# EasyEDA Pro project Hikikomori-base-esp32c6-dev-v0.1.epro

# Schematic Main board
Board Name: Main board; Create Date: 2024-10-02; Page Name: P1; Project Name: Hikikomori-base-esp32c6-dev-v0.1; Schematic Name: Main board; Update Date: 2024-12-02; Company: Robonomics.network; Drawed: ludovich88; Page Size: A4; Part Number: SWS-1G-E-ESP_MB; Reviewed: ludovich88; Version: V0.1
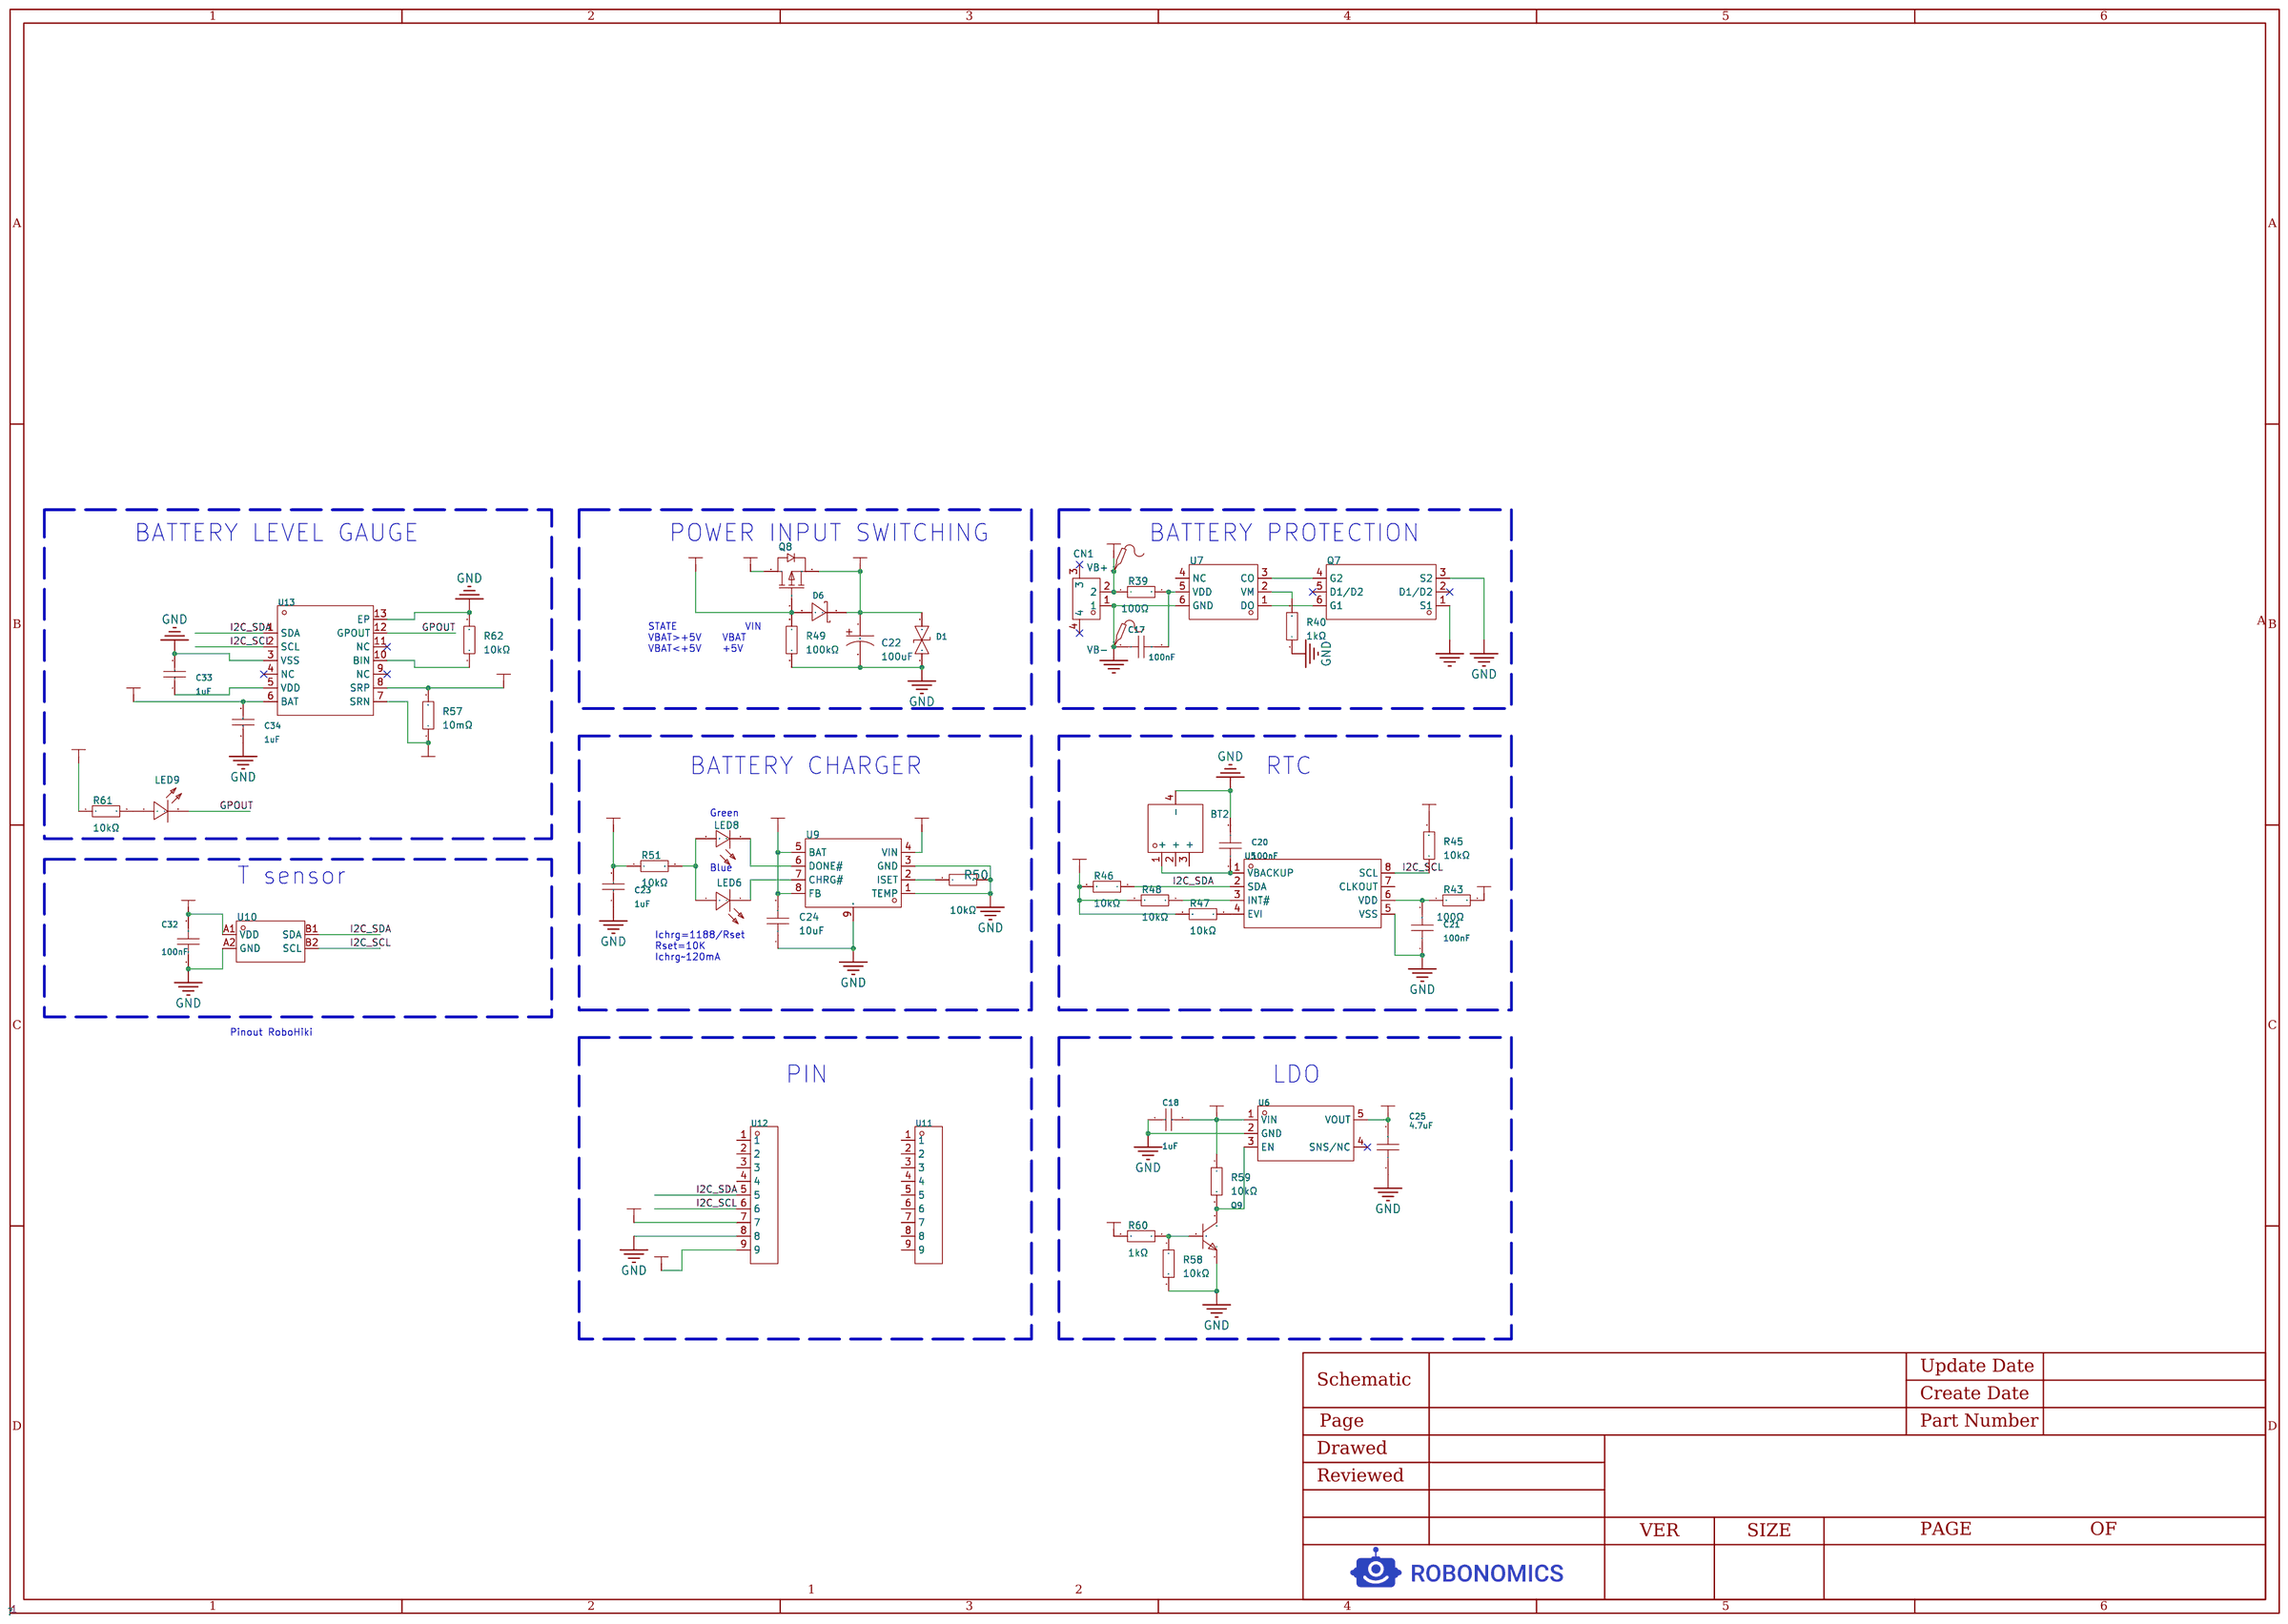
[diagram p0: schematic sheet]

## Parts
BT2  MY-521-01  [BAT-SMD_MY-521-01]
C17  100nF  [C0402]
C18  1uF  [C0402]
C20  100nF  [C0402]
C21  100nF  [C0402]
C22  100uF  [CAP-SMD_L3.5-W2.8-R-RD]
C23  1uF  [C0402]
C24  10uF  [C0402]
C25  4.7uF  [C0402]
C32  100nF  [C0402]
C33  1uF  [C0402]
C34  1uF  [C0402]
CN1  A2001WR-S-2P  [CONN-SMD_2P-P2.00_A2001WR-S-2P]  (no BOM)
D1  LESD5D5.0CT1G  [SOD-523_L1.2-W0.8-LS1.6-BI]
D6  BAT60AE6327  [SOD-323_L1.8-W1.3-LS2.5-RD]
LED6  16-213/BHC-AN1P2/3T  [LED0402-R-RD]
LED8  16-213/GHC-YR1S1/3T  [LED0402-R-RD]
LED9  16-213UYOC/S530-A2/TR8  [LED0402-R-RD]
Q7  SL8205S  [SOT-23-6_L2.9-W1.6-P0.95-LS2.8-BL]
Q8  CJ2301 S1  [SOT-23-3_L3.0-W1.7-P0.95-LS2.9-BR]
Q9  2N3904S-RTK/PS  [SOT-23-3_L2.9-W1.3-P1.90-LS2.4-TR]
R39  100Ω  [R0402]
R40  1kΩ  [R0402]
R43  100Ω  [R0402]
R45  10kΩ  [R0402]
R46  10kΩ  [R0402]
R47  10kΩ  [R0402]
R48  10kΩ  [R0402]
R49  100kΩ  [R0402]
R50  10kΩ  [R0603]
R51  10kΩ  [R0402]
R57  10mΩ  [R0603]
R58  10kΩ  [R0402]
R59  10kΩ  [R0402]
R60  1kΩ  [R0402]  (no BOM)
R61  10kΩ  [R0402]
R62  10kΩ  [R0402]
U5  RV-3032-C7-32.768KHZ-2.5PPM-TA-QA  [DFN-8_L3.2-W1.5-P0.9-BL]
U6  RT9078-33GJ5  [TSOT-23-5_L2.9-W1.6-P0.95-LS2.8-BR]
U7  DW01A  [SOT-23-6_L2.9-W1.6-P0.95-LS2.8-BL]
U9  CN3165  [DFN-8_L3.0-W3.0-P0.50-BL-EP]
U10  MAX31875R0TZS+T  [WLP-4_L0.8-W0.8-R2-C2-P0.40-TL]
U11  XDZ254-1-09-Z-2.5-G1  [HDR-TH_9P-P2.54-V-M]
U12  XDZ254-1-09-Z-2.5-G1  [HDR-TH_9P-P2.54-V-M]
U13  BQ27441DRZR-G1B  [SON-12_L4.0-W2.5-P0.40-BL-EP]
VB+  -  [Test-Point-0.5mm]  (no BOM)
VB-  -  [Test-Point-0.5mm]  (no BOM)

## Library data of the parts
BT2 = MY-521-01: Connector Type:Battery clip Battery Type:SR521 Contact Material:Phosphor Bronze Contact Plating:Silver Operating Temperature Range:- Operating Temperature Range:-; LCSC Part Name: 电池扣 适用电池:SR521; Supplier Part: C964848; Manufacturer: MYOUNG(美阳); Supplier Footprint: SMD; Datasheet: https://atta.szlcsc.com/upload/public/pdf/source/20201218/C964848_4AB8D6E0B12E9D850A42CAB87A92C7AA.pdf; Supplier: LCSC; Connector Type: Battery clip; Battery Type: SR521; Contact Material: Phosphor Bronze; Contact Plating: Silver
C17 C20 C21 C32 = CC0402KRX7R7BB104: Capacitance: Tolerance:±10% Tolerance:±10% Voltage Rated: Temperature Coefficient:; LCSC Part Name: 100nF ±10% 16V; Supplier Part: C60474; Manufacturer: YAGEO(国巨); Supplier Footprint: 0402; Datasheet: https://atta.szlcsc.com/upload/public/pdf/source/20211223/9278FD768280B81DDBEF48FA36411A03.pdf; Supplier: LCSC; Tolerance: ±10%
C18 C23 C33 C34 = CL05A105KO5NNNC: Capacitance: Tolerance:±10% Tolerance:±10% Voltage Rated: Temperature Coefficient:; LCSC Part Name: 1uF ±10% 16V; Supplier Part: C29266; Manufacturer: SAMSUNG(三星); Supplier Footprint: 0402; Datasheet: https://atta.szlcsc.com/upload/public/pdf/source/20160218/1457707763339.pdf; Supplier: LCSC; Tolerance: ±10%
C22 = 293D107X96R3B2TE3: Capacitance: Tolerance:±10% Tolerance:±10% Rated Voltage: Equivalent Series Resistance(ESR):1.7Ω@100kHz Operating Temperature:-55℃~+125℃ Operating Temperature:-55℃~+125℃; LCSC Part Name: 100uF ±10% 6.3V; Supplier Part: C136004; Manufacturer: VISHAY(威世); Supplier Footprint: CASE-B-3528; JLCPCB Part Class: Extended Part; Datasheet: https://atta.szlcsc.com/upload/public/pdf/source/20180326/C136005_D73530D2C967FFE6345491EA9D499B4C.pdf; Supplier: LCSC; Tolerance: ±10%; Equivalent Series Resistance(ESR): 1.7Ω@100kHz; Operating Temperature: -55℃~+125℃
C24 = CL05A106MP5NUNC_C315248: Capacitance: Tolerance:±20% Tolerance:±20% Voltage Rated: Temperature Coefficient:; LCSC Part Name: 10uF ±20% 10V; Supplier Part: C315248; Manufacturer: SAMSUNG(三星); Manufacturer Part: CL05A106MP5NUNC; Supplier Footprint: 0402; Datasheet: https://atta.szlcsc.com/upload/public/pdf/source/20231220/1EF805BAE1520675928CC4638D279E74.pdf; Supplier: LCSC; Tolerance: ±20%
C25 = CL05A475KP5NRNC: Capacitance: Tolerance:±10% Tolerance:±10% Voltage Rated: Temperature Coefficient:; LCSC Part Name: 4.7uF ±10% 10V; Supplier Part: C368809; Manufacturer: SAMSUNG(三星); Supplier Footprint: 0402; Datasheet: https://atta.szlcsc.com/upload/public/pdf/source/20160218/1457707763339.pdf; Supplier: LCSC; Tolerance: ±10%
CN1 = A2001WR-S-2P: LCSC Part Name: PH2.0 卧贴 1X2P; Supplier Part: C375128; Manufacturer: CNJM(九木精密); Supplier Footprint: SMD; Datasheet: https://atta.szlcsc.com/upload/public/pdf/source/20190312/C375153_A3CA63057DD9112FB0BD059C4CD87155.pdf; Supplier: LCSC
D1 = LESD5D5.0CT1G: polarity:Bi-Directional Reverse Stand-Off Voltage (Vrwm):5V Maximum Clamping Voltage:18.6V Peak Pulse Current (Ipp)@10/1000us:9.4A Breakdown Voltage:5.6V Type:ESD; LCSC Part Name: 双向ESD; Supplier Part: C383211; Manufacturer: LRC(乐山无线电); Supplier Footprint: SOD-523; JLCPCB Part Class: Extended Part; Datasheet: https://atta.szlcsc.com/upload/public/pdf/source/20190807/C383211_633DF4B4E2C161403226E5235FE33A1C.pdf; Supplier: LCSC; polarity: Bi-Directional; Reverse Stand-Off Voltage (Vrwm): 5V; Maximum Clamping Voltage: 18.6V; Peak Pulse Current (Ipp)@10/1000us: 9.4A; Breakdown Voltage: 5.6V; Type: ESD
D6 = BAT60AE6327_C117485: Forward Voltage (Vf@If):370mV@1A Reverse Voltage (Vr):10V Average Rectified Current (Io):3A; LCSC Part Name: 电压:10V 电流:3A; Supplier Part: C117485; Manufacturer: Infineon(英飞凌); Supplier Footprint: SOD-323; Datasheet: https://atta.szlcsc.com/upload/public/pdf/source/20190819/C412736_AE17339F97C252D9C798252AC051EF30.pdf; Supplier: LCSC; Forward Voltage (Vf@If): 370mV@1A; Reverse Voltage (Vr): 10V; Average Rectified Current (Io): 3A
LED6 = 16-213/BHC-AN1P2/3T: Emitted Color:Blue; LCSC Part Name: 蓝灯; Supplier Part: C131223; Manufacturer: EVERLIGHT(亿光); Supplier Footprint: 0402; JLCPCB Part Class: Extended Part; Datasheet: https://atta.szlcsc.com/upload/public/pdf/source/20180227/C131223_15197014144351370257.pdf; Supplier: LCSC; Emitted Color: Blue
LED8 = 16-213/GHC-YR1S1/3T: Emitted Color:Emerald Power Dissipation:110mW Forward Current:20mA Dominant Wavelength:520nm~535nm Dominant Wavelength:520nm~535nm Peak Wavelength:518nm Diode Configuration:- Lens Color:无色透明透镜 Color Temperature:- Color Temperature:- Viewing Angle:120° Mou; LCSC Part Name: 翠绿; Supplier Part: C74338; Manufacturer: EVERLIGHT(亿光); Supplier Footprint: 0402; Datasheet: https://atta.szlcsc.com/upload/public/pdf/source/20160606/1465200212329.pdf; Supplier: LCSC; Emitted Color: Emerald; Power Dissipation: 110mW; Forward Current: 20mA; Dominant Wavelength: 520nm~535nm; Peak Wavelength: 518nm; Lens Color: 无色透明透镜; Viewing Angle: 120°; Operating Temperature: -40℃~+85℃
LED9 = 16-213UYOC/S530-A2/TR8: Emitted Color:Orange; LCSC Part Name: 橙灯; Supplier Part: C88330; Manufacturer: EVERLIGHT(亿光); Supplier Footprint: 0402; JLCPCB Part Class: Extended Part; Datasheet: https://atta.szlcsc.com/upload/public/pdf/source/20180423/C88330_69D68B8C9D59C37D6019D2A42E6579CE.pdf; Supplier: LCSC; Emitted Color: Orange
Q7 = SL8205S: Type:2 N-Channel Drain Source Voltage (Vdss): Continuous Drain Current (Id): Power Dissipation (Pd): Drain Source On Resistance (RDS(on)@Vgs,Id):27mΩ@4.5V,5A Gate Threshold Voltage (Vgs(th)@Id):1.2V@250uA Configuration:Common Drain; LCSC Part Name: 2个N沟道 耐压:20V 电流:5A; Supplier Part: C359990; Manufacturer: Slkor(萨科微); Supplier Footprint: SOT-23-6; JLCPCB Part Class: Extended Part; Datasheet: https://atta.szlcsc.com/upload/public/pdf/source/20190627/C359990_9C880E926E3F18206F64B33A1D5D570E.pdf; Supplier: LCSC; Type: 2 N-Channel; Drain Source On Resistance (RDS(on)@Vgs,Id): 27mΩ@4.5V,5A; Gate Threshold Voltage (Vgs(th)@Id): 1.2V@250uA; Configuration: Common Drain
Q8 = CJ2301 S1: Type:1个PChannel Drain Source Voltage (Vdss): Continuous Drain Current (Id): Power Dissipation (Pd): Drain Source On Resistance (RDS(on)@Vgs,Id):112mΩ@4.5V,2.8A Gate Threshold Voltage (Vgs(th)@Id):1V@250uA Total Gate Charge (Qg@Vgs):- Input Capacitance (Ci; LCSC Part Name: 1个P沟道 耐压:20V 电流:2.3A; Supplier Part: C8547; Manufacturer: CJ(江苏长电/长晶); Supplier Footprint: SOT-23; JLCPCB Part Class: Extended Part; Datasheet: https://atta.szlcsc.com/upload/public/pdf/source/20140815/1457707224119.pdf; Supplier: LCSC; Type: 1个PChannel; Drain Source On Resistance (RDS(on)@Vgs,Id): 112mΩ@4.5V,2.8A; Gate Threshold Voltage (Vgs(th)@Id): 1V@250uA
Q9 = 2N3904S-RTK/PS_C18536: Transistor Type: Collector Current (Ic): Collector-Emitter Breakdown Voltage (Vceo): Power Dissipation (Pd): DC Current Gain (hFE@Ic,Vce):100@10mA,1V DC Current Gain (hFE@Ic,Vce):100@10mA,1V Transition Frequency (fT):300MHz Collector Cut-Off Current (Icbo; LCSC Part Name: NPN 电流:200mA 耐压:40V; Supplier Part: C18536; Manufacturer: KEC; Supplier Footprint: SOT-23; JLCPCB Part Class: Extended Part; Datasheet: https://atta.szlcsc.com/upload/public/pdf/source/20180105/C112667_15151500846781234146.pdf; Supplier: LCSC; DC Current Gain (hFE@Ic,Vce): 100@10mA,1V; Transition Frequency (fT): 300MHz; Collector-Emitter Saturation Voltage (VCE(sat)@Ic,Ib): 300mV@50mA,5mA
R39 R43 = RC0402FR-07100RL: Type:Thick Film Resistors Resistance: Tolerance:±1% Tolerance:±1% Power(Watts): Overload Voltage (Max): Temperature Coefficient:±100ppm/℃ Temperature Coefficient:±100ppm/℃ Operating Temperature Range:-55℃~+155℃ Operating Temperature Range:-55℃~+155℃; LCSC Part Name: 厚膜电阻 100Ω ±1% 62.5mW; Supplier Part: C106232; Manufacturer: YAGEO(国巨); Supplier Footprint: 0402; JLCPCB Part Class: Extended Part; Datasheet: https://atta.szlcsc.com/upload/public/pdf/source/20180927/C295883_E8D83085EA81BD7DE0B2B681138C15EE.pdf; Supplier: LCSC; Type: Thick Film Resistors; Tolerance: ±1%; Temperature Coefficient: ±100ppm/℃; Operating Temperature Range: -55℃~+155℃
R40 R60 = RC0402FR-071KL: Type:Thick Film Resistors Resistance: Tolerance:±1% Tolerance:±1% Power(Watts): Overload Voltage (Max): Temperature Coefficient:±100ppm/℃ Temperature Coefficient:±100ppm/℃ Operating Temperature Range:-55℃~+155℃ Operating Temperature Range:-55℃~+155℃; LCSC Part Name: 厚膜电阻 1kΩ ±1% 62.5mW; Supplier Part: C106235; Manufacturer: YAGEO(国巨); Supplier Footprint: 0402; Datasheet: https://atta.szlcsc.com/upload/public/pdf/source/20180927/C295883_E8D83085EA81BD7DE0B2B681138C15EE.pdf; Supplier: LCSC; Type: Thick Film Resistors; Tolerance: ±1%; Temperature Coefficient: ±100ppm/℃; Operating Temperature Range: -55℃~+155℃
R45-R48 R51 R58 R59 R61 R62 = RC0402FR-0710KL: Type:Thick Film Resistors Resistance: Tolerance:±1% Tolerance:±1% Power(Watts): Overload Voltage (Max): Temperature Coefficient:±100ppm/℃ Temperature Coefficient:±100ppm/℃ Operating Temperature Range:-55℃~+155℃ Operating Temperature Range:-55℃~+155℃; LCSC Part Name: 厚膜电阻 10kΩ ±1% 62.5mW; Supplier Part: C60490; Manufacturer: YAGEO(国巨); Supplier Footprint: 0402; Datasheet: https://atta.szlcsc.com/upload/public/pdf/source/20170925/C131467_1506321478108990263.pdf; Supplier: LCSC; Type: Thick Film Resistors; Tolerance: ±1%; Temperature Coefficient: ±100ppm/℃; Operating Temperature Range: -55℃~+155℃
R49 = RC0402FR-07100KL: Type:Thick Film Resistors Resistance: Tolerance:±1% Tolerance:±1% Power(Watts): Overload Voltage (Max): Temperature Coefficient:±100ppm/℃ Temperature Coefficient:±100ppm/℃ Operating Temperature Range:-55℃~+155℃ Operating Temperature Range:-55℃~+155℃; LCSC Part Name: 厚膜电阻 100kΩ ±1% 62.5mW; Supplier Part: C60491; Manufacturer: YAGEO(国巨); Supplier Footprint: 0402; JLCPCB Part Class: Extended Part; Datasheet: https://atta.szlcsc.com/upload/public/pdf/source/20180927/C295883_E8D83085EA81BD7DE0B2B681138C15EE.pdf; Supplier: LCSC; Type: Thick Film Resistors; Tolerance: ±1%; Temperature Coefficient: ±100ppm/℃; Operating Temperature Range: -55℃~+155℃
R50 = 0603WAF1002T5E: Type:Thick Film Resistors Resistance:10kΩ Tolerance:±1% Tolerance:±1% Power(Watts): Overload Voltage (Max): Temperature Coefficient:±100ppm/℃ Temperature Coefficient:±100ppm/℃ Operating Temperature Range:-55℃~+155℃ Operating Temperature Range:-55℃~+155℃; LCSC Part Name: 厚膜电阻 10kΩ ±1% 100mW; Supplier Part: C25804; Manufacturer: UNI-ROYAL(厚声); Supplier Footprint: 0603; JLCPCB Part Class: Basic Part; Datasheet: https://atta.szlcsc.com/upload/public/pdf/source/20200306/C422600_1E6D84923E4A46A82E41ADD87F860B5C.pdf; Supplier: LCSC; Type: Thick Film Resistors; Tolerance: ±1%; Temperature Coefficient: ±100ppm/℃; Operating Temperature Range: -55℃~+155℃
R57 = STE0603MW50R010F: Resistance: Tolerance:±1% Tolerance:±1% Power(Watts): Temperature Coefficient:±50ppm/℃ Temperature Coefficient:±50ppm/℃; LCSC Part Name: 10mΩ ±1% 500mW; Supplier Part: C156369; Manufacturer: WALTER(华德); Supplier Footprint: 0603; Datasheet: https://atta.szlcsc.com/upload/public/pdf/source/20190620/C388471_536FA2A120C516F48DEDAE856055D3B0.pdf; Supplier: LCSC; Tolerance: ±1%; Temperature Coefficient: ±50ppm/℃
U5 = RV-3032-C7-32.768KHZ-2.5PPM-TA-QA: Interface:I2C Operating Voltage:1.3V~5.5V Operating Voltage:1.3V~5.5V Operating Temperature:-40℃~+105℃ Operating Temperature:-40℃~+105℃; Supplier Part: C5366550; Manufacturer: Micro Crystal(瑞士微晶); Supplier Footprint: SON-8(1.5x3.2); Supplier: LCSC; Interface: I2C; Operating Voltage: 1.3V~5.5V; Operating Temperature: -40℃~+105℃
U6 = RT9078-33GJ5: Output Type: Maximum Input Voltage:5.5V Output Voltage:3.3V Output Voltage:3.3V MAX Output Current:300mA Power Supply Rejection Ratio (PSRR):75dB@(1kHz) Dropout Voltage:200mV@(300mA) standby current:4uA Operating Temperature:-40℃~+85℃@(Ta) Operating Tempe; LCSC Part Name: 输入5.5V 输出3.3V 300mA; Supplier Part: C110427; Manufacturer: RICHTEK(立锜); Supplier Footprint: TSOT-23-5; JLCPCB Part Class: Extended Part; Datasheet: https://atta.szlcsc.com/upload/public/pdf/source/20181012/C110427_459EC5FD15636F8412987EB534667A0F.pdf; Supplier: LCSC; Maximum Input Voltage: 5.5V; Output Voltage: 3.3V; MAX Output Current: 300mA; Power Supply Rejection Ratio (PSRR): 75dB@(1kHz); Dropout Voltage: 200mV@(300mA); standby current: 4uA; Operating Temperature: -40℃~+85℃@(Ta); Output Polarity: Positive electrode; Number of Outputs: 1
U7 = DW01A_C436931: Supplier Part: C436931; Manufacturer: TF(拓锋); Supplier Footprint: SOT-23-6L; JLCPCB Part Class: Extended Part; Datasheet: https://atta.szlcsc.com/upload/public/pdf/source/20191121/C436931_2F3233FCEFFE76204A0A035C9B3278D6.pdf; Supplier: LCSC
U9 = CN3165: Supplier Part: C559035; Manufacturer: CONSONANCE(上海如韵); Supplier Footprint: DFN-8-EP(3x3); JLCPCB Part Class: Extended Part; Datasheet: https://atta.szlcsc.com/upload/public/pdf/source/20200525/C559035_566DAD165346C4349A58ACB297653FA2.pdf; Supplier: LCSC
U10 = MAX31875R0TZS+T: Supply Voltage:1.6V~3.6V Supply Voltage:1.6V~3.6V; Supplier Part: C3663366; Manufacturer: ADI(亚德诺)/MAXIM(美信); Supplier Footprint: WLP-4(0.8x0.8); JLCPCB Part Class: Extended Part; Datasheet: https://atta.szlcsc.com/upload/public/pdf/source/20230919/4D8AEDC7ECFD02D78D7EAE216C0A65CF.pdf; Supplier: LCSC; Supply Voltage: 1.6V~3.6V
U11 U12 = XDZ254-1-09-Z-2.5-G1: Pin Structure:1x9P Pitch:2.54mm Circluar Pins/Square Pins:Policy Mounting Type:Direct Insert Number of Rows:Single Row Number of Pins:9P Current Rating (Max):3A Length of Mating Pin:6mm Insulation Height:2.5mm Length of End Connection Pin:3mm Operating Te; LCSC Part Name: 间距:2.54mm 1x9P 直插 方针; Supplier Part: C18905850; Manufacturer: XUNDA(讯答); Supplier Footprint: 插件,P=2.54mm; JLCPCB Part Class: Extended Part; Datasheet: https://atta.szlcsc.com/upload/public/pdf/source/20231019/B07AD669ED74A6E3E65E4CCF814A6B3E.pdf; Supplier: LCSC; Pin Structure: 1x9P; Pitch: 2.54mm; Circluar Pins/Square Pins: Policy; Mounting Type: Direct Insert; Number of Rows: Single Row; Number of Pins: 9P; Current Rating (Max): 3A; Length of Mating Pin: 6mm; Insulation Height: 2.5mm; Length of End Connection Pin: 3mm; Operating Temperature Range: -40℃~+105℃; Color: Black
U13 = BQ27441DRZR-G1B: Supplier Part: C473374; Manufacturer: TI(德州仪器); Supplier Footprint: SON-12-EP(2.5x4); Datasheet: https://www.ti.com/cn/lit/gpn/bq27441-g1; Supplier: LCSC
VB+ VB- = Test-Point: Test Point 测试点

## Nets
3V3: C25.2 C32.2 R43.2 R45.2 R46.2 R47.2 R48.2 U6.5(VOUT) U10.A1(VDD) U12.7
+5V: C23.2 D6.2(A) Q8.1(G) R49.2 R51.1 R60.2 U9.4(VIN) U12.9
GND: BT2.4(-) C18.1 C20.2 C21.1 C22.2 C23.1 C24.1 C25.1 C32.1 C33.2 C34.1 D1.2 Q7.3(S2) Q9.1(E) R40.1 R49.1 R50.2 R58.2 R62.2 U5.5(VSS) U6.2(GND) U9.1(TEMP) U9.3(GND) U9.9(PAD) U10.A2(GND) U12.8 U13.3(VSS) U13.13(EP)
VBAT0+: C24.2 C34.2 CN1.2 R39.1 R57.2 U9.5(BAT) U9.8(FB) U13.6(BAT) U13.8(SRP) VB+.1
VBAT+: Q8.3(D) R57.1 R61.1 U13.7(SRN)
VBAT-: C17.1 CN1.1 Q7.1(S1) U7.6(GND) VB-.1
VIN: C18.2 C22.1 D1.1 D6.1(K) Q8.2(S) R59.1 U6.1(VIN)
GPOUT: LED9.2(K) U13.12(GPOUT)
I2C_SCL: R45.1 U5.8(SCL) U10.B2(SCL) U12.6 U13.2(SCL)
I2C_SDA: R46.1 U5.2(SDA) U10.B1(SDA) U12.5 U13.1(SDA)
$1N106648: C17.2 R39.2 U7.5(VDD)
$1N106789: R40.2 U7.2(VM)
$1N106794: Q7.4(G2) U7.3(CO)
$1N106798: Q7.6(G1) U7.1(DO)
$1N107717: C21.2 R43.1 U5.6(VDD)
$1N107912: R48.1 U5.3(INT#)
$1N107921: R47.1 U5.4(EVI)
$1N109045: LED8.2(C) U9.6(DONE#)
$1N109050: LED6.2(K) U9.7(CHRG#)
$1N109056: LED6.1(A) LED8.1(A) R51.2
$1N109292: R50.1 U9.2(ISET)
$1N117711: Q9.3(C) R59.2 U6.3(EN)
$1N117737: Q9.2(B) R58.1 R60.1
$1N124047: BT2.1(+) C20.1 U5.1(VBACKUP)
$1N125737: LED9.1(A) R61.2
$1N125738: R62.1 U13.10(BIN)
$1N125753: C33.1 U13.5(VDD)

Not connected (* = marked no-connect by the designer): BT2 2(+) 3(+); CN1 3* 4*; Q7 2(D1/D2)* 5(D1/D2)*; U5 7(CLKOUT); U6 4(SNS/NC)*; U7 4(NC); U11 1 2 3 4 5 6 7 8 9; U12 1 2 3 4; U13 4(NC)* 9(NC)* 11(NC)*

## Notes on the sheet
- BATTERY LEVEL GAUGE
- POWER INPUT SWITCHING
- BATTERY PROTECTION
- STATE             VIN
  VBAT>+5V    VBAT
  VBAT<+5V    +5V
- BATTERY CHARGER
- RTC
- Green
- Blue
- T sensor
- Ichrg=1188/Rset
  Rset=10K
  Ichrg~120mA
- Pinout RoboHiki
- PIN
- LDO

# Board Main board
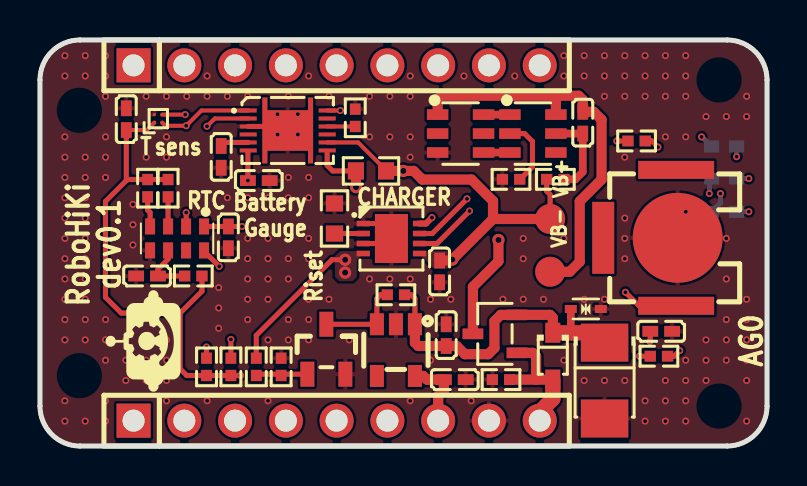
[diagram p1: board, top side]
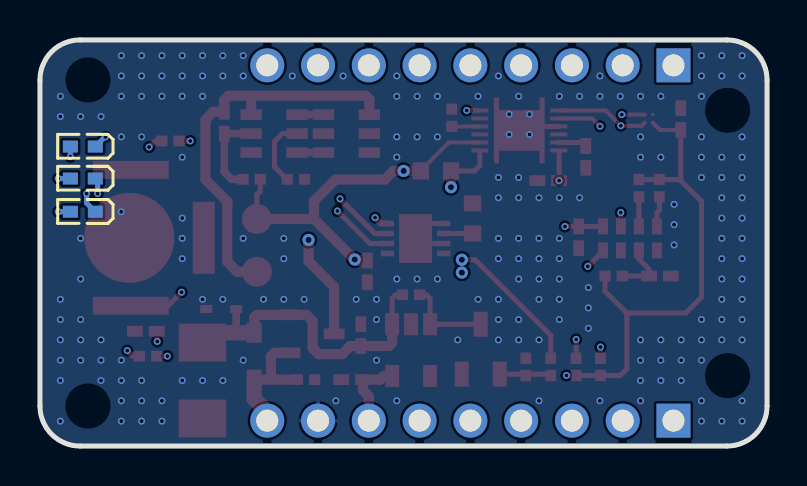
[diagram p2: board, bottom side, seen from below]

Outline 36.37 x 20.32 mm; copper layers: Top Layer, Inner1, Inner2, Bottom Layer. Coordinates in mm from the lower left corner of the outline.
Outline path: 0,18.32 0,2 arc(0.59,0.59) 2,0 34.37,0 arc(35.78,0.59) 36.37,2 36.37,18.32 arc(35.78,19.73) 34.37,20.32 2,20.32 arc(0.59,19.73) 0,18.32
Stack: Top Layer 0.035mm Outer layer copper thickness 1oz / Dielectric1 0.0994mm 3313 RC57% 4.2mil / Inner1 0.0152mm Inner layer copper thickness / Dielectric2 1.265mm 1.3mm H/HOZ Copper / Inner2 0.0152mm Inner layer copper thickness / Dielectric3 0.0994mm 3313 RC57% 4.2mil / Bottom Layer 0.035mm Outer layer copper thickness 1oz

## Design rules (mm)
template: User Custom Config
spacing safeClearance (default): track to track 0.152, other pairs 0.152 to 0.3
track width trackWidth (default): min 0.127, default 0.254, max 2.54
track width trackWidth1: min 0.127, default 0.127, max 2.54
differential pair differentialPair (default): width min 0.127, default 0.254, max 2.54; gap min 0.152, default 0.152
differential pair differentialPair_usb: width min 0.13, default 0.13, max 0.201; gap min 0.127, default 0.127
via viaSize (default): diameter min 0.249, default 0.351, max 10; hole min 0.099, default 0.201, max 5.999
pour e1465 uses copperRegion
pour e1464 uses copperRegion
pour e1479 uses copperRegion

## Placement (name value [footprint] x y rotation side)
BT2  MY-521-01  [BAT-SMD_MY-521-01]  30.04 10.42 90 top
C17  100nF  [C0402]  27.15 16.18 270 top
C18  1uF  [C0402]  20.32 5.55 270 top
C20  100nF  [C0402]  9.42 10.44 270 top
C21  100nF  [C0402]  5.35 8.51 0 top
C22  100uF  [CAP-SMD_L3.5-W2.8-R-RD]  28.25 3.28 90 top
C23  1uF  [C0402]  31.07 5.74 180 top
C24  10uF  [C0402]  19.99 8.74 90 top
C25  4.7uF  [C0402]  20.75 3.32 180 top
C32  100nF  [C0402]  4.32 16.36 270 top
C33  1uF  [C0402]  9.07 14.47 270 top
C34  1uF  [C0402]  10.95 13.28 180 top
D1  LESD5D5.0CT1G  [SOD-523_L1.2-W0.8-LS1.6-BI]  27.31 6.86 0 top
D6  BAT60AE6327  [SOD-323_L1.8-W1.3-LS2.5-RD]  25.65 4.5 270 top
LED6  16-213/BHC-AN1P2/3T  [LED0402-R-RD]  34.23 11.72 0 bottom
LED8  16-213/GHC-YR1S1/3T  [LED0402-R-RD]  34.23 13.39 0 bottom
LED9  16-213UYOC/S530-A2/TR8  [LED0402-R-RD]  34.23 14.99 0 bottom
Q7  SL8205S  [SOT-23-6_L2.9-W1.6-P0.95-LS2.8-BL]  21.04 15.64 270 top
Q8  CJ2301 S1  [SOT-23-3_L3.0-W1.7-P0.95-LS2.9-BR]  22.76 5.61 0 top
Q9  2N3904S-RTK/PS  [SOT-23-3_L2.9-W1.3-P1.90-LS2.4-TR]  14.33 4.84 270 top
R39  100Ω  [R0402]  25.78 13.35 0 top
R40  1kΩ  [R0402]  23.57 13.35 0 top
R43  100Ω  [R0402]  7.67 8.51 0 top
R45  10kΩ  [R0402]  9.55 3.96 270 top
R46  10kΩ  [R0402]  8.33 3.96 270 top
R47  10kΩ  [R0402]  5.38 12.9 90 top
R48  10kΩ  [R0402]  6.41 12.9 90 top
R49  100kΩ  [R0402]  23.06 3.32 0 top
R50  10kΩ  [R0603]  14.73 11.39 90 top
R51  10kΩ  [R0402]  30.96 4.5 0 top
R57  10mΩ  [R0603]  16.56 13.77 0 top
R58  10kΩ  [R0402]  12.06 3.96 90 top
R59  10kΩ  [R0402]  17.81 7.57 180 top
R60  1kΩ  [R0402]  10.82 3.96 90 top
R61  10kΩ  [R0402]  29.84 15.27 0 top
R62  10kΩ  [R0402]  15.77 16.42 90 top
U5  RV-3032-C7-32.768KHZ-2.5PPM-TA-QA  [DFN-8_L3.2-W1.5-P0.9-BL]  6.86 10.39 180 top
U6  RT9078-33GJ5  [TSOT-23-5_L2.9-W1.6-P0.95-LS2.8-BR]  17.81 4.8 90 top
U7  DW01A  [SOT-23-6_L2.9-W1.6-P0.95-LS2.8-BL]  24.66 15.64 270 top
U9  CN3165  [DFN-8_L3.0-W3.0-P0.50-BL-EP]  17.58 10.38 270 top
U10  MAX31875R0TZS+T  [WLP-4_L0.8-W0.8-R2-C2-P0.40-TL]  5.92 16.38 90 top
U11  XDZ254-1-09-Z-2.5-G1  [HDR-TH_9P-P2.54-V-M]  14.84 19.05 0 top
U12  XDZ254-1-09-Z-2.5-G1  [HDR-TH_9P-P2.54-V-M]  14.84 1.27 0 top
U13  BQ27441DRZR-G1B  [SON-12_L4.0-W2.5-P0.40-BL-EP]  12.39 15.79 270 top
VB+  -  [Test-Point-0.5mm]  25.52 11.36 270 top
VB-  -  [Test-Point-0.5mm]  25.52 8.72 270 top

## Footprints (pads in the part's own frame, mm; a bottom-side part is the same pattern mirrored in y, then rotated)
BAT-SMD_MY-521-01
  rect 0.9x3.8 smd: 1(-3.4,-1.788) 3(3.4,-1.788)
  rect 3.6x1.1 smd: 2(0,1.863)
  round 4.5 smd: 4(0,-1.863)
C0402
  rect 0.79x0.54 smd: 1(-0.545,0) 2(0.545,0)
CAP-SMD_L3.5-W2.8-R-RD
  rect 1.9x2.376 smd: 1(1.899,0) 2(-1.899,0)
DFN-8_L3.0-W3.0-P0.50-BL-EP
  rect 0.28x0.665 smd: 1(-0.75,-1.407) 2(-0.25,-1.407) 3(0.25,-1.407) 4(0.75,-1.407) 5(0.75,1.407) 6(0.25,1.407) 7(-0.25,1.407) 8(-0.75,1.407)
  rect 2.45x1.65 smd: 9(0,0)
DFN-8_L3.2-W1.5-P0.9-BL
  rect 0.5x0.8 smd: 1(-1.35,-0.6) 2(-0.45,-0.6) 3(0.45,-0.6) 4(1.35,-0.6) 5(1.35,0.6) 6(0.45,0.6) 7(-0.45,0.6) 8(-1.35,0.6)
HDR-TH_9P-P2.54-V-M
  rect 1.7x1.7 hole 1.1: 1(-10.16,0)
  round 1.7 hole 1.1: 2(-7.62,0) 3(-5.08,0) 4(-2.54,0) 5(0,0) 6(2.54,0) 7(5.08,0) 8(7.62,0) 9(10.16,0)
LED0402-R-RD
  rect 0.75x0.6 smd: 1(0.623,0) 2(-0.623,0)
R0402
  rect 0.566x0.54 smd: 1(-0.433,0) 2(0.433,0)
R0603
  rect 0.806x0.864 smd: 1(-0.753,0) 2(0.753,0)
SOD-323_L1.8-W1.3-LS2.5-RD
  rect 1x0.75 smd: 1(-1.173,0) 2(1.173,0)
SOD-523_L1.2-W0.8-LS1.6-BI
  rect 0.6x0.4 smd: 1(-0.75,0) 2(0.75,0)
SON-12_L4.0-W2.5-P0.40-BL-EP
  rect 0.2x0.85 smd: 1(-1,-1.975) 2(-0.6,-1.975) 3(-0.2,-1.975) 4(0.2,-1.975) 5(0.6,-1.975) 6(1,-1.975) 7(1,1.975) 8(0.6,1.975) 9(0.2,1.975) 10(-0.2,1.975) 11(-0.6,1.975) 12(-1,1.975)
  custom 3.302x2.54 smd: 13(0.001,0)
SOT-23-3_L2.9-W1.3-P1.90-LS2.4-TR
  rect 1.25x0.7 smd: 1(1.25,0.95) 2(1.25,-0.95) 3(-1.25,0)
SOT-23-3_L3.0-W1.7-P0.95-LS2.9-BR
  rect 1.038x0.532 smd: 1(1.101,-0.95) 2(1.101,0.95) 3(-1.101,0)
SOT-23-6_L2.9-W1.6-P0.95-LS2.8-BL
  rect 0.532x1.072 smd: 1(-0.95,-1.149) 2(0,-1.149) 3(0.95,-1.149) 4(0.95,1.149) 5(0,1.149) 6(-0.95,1.149)
Test-Point-0.5mm
  round 1.5 smd: 1(0,0)
TSOT-23-5_L2.9-W1.6-P0.95-LS2.8-BR
  rect 1.1x0.7 smd: 1(1.294,-0.951) 2(1.294,-0.001) 3(1.294,0.951) 4(-1.294,0.951) 5(-1.294,-0.949)
WLP-4_L0.8-W0.8-R2-C2-P0.40-TL
  round 0.17 smd: A1(-0.2,0.2) A2(0.2,0.2) B1(-0.2,-0.2) B2(0.2,-0.2)

## Nets
As in the schematic.

Pads without a net: BT2 2 3; Q7 2 5; U5 7; U6 4; U7 4; U11 1 2 3 4 5 6 7 8 9; U12 1 2 3 4; U13 4 9 11

## Via types
v1: diameter 0.35, hole 0.201, Top Layer to Bottom Layer, 213 vias
v2: diameter 0.61, hole 0.305, Top Layer to Bottom Layer, 6 vias

## Routing (per net, layer and track width the routed paths; a pad name or vN(x,y) marks a point on that pad's centre or on a via; arc(x,y) is an arc through that point)
3V3: length 40.1
  Top Layer w0.203: U10.A1 5.35,15.81 C32.2
  Top Layer w0.254: 4.32,13.28 C32.2 ; 4.32,13.28 4.37,13.34 R47.2 R48.2 ; 4.32,13.28 3.28,12.24 3.28,7.44 4.06,6.66 7.01,6.66 ; 7.01,6.66 8.1,7.75 8.1,8.51 ; 7.01,6.66 7.01,3.86 7.34,3.53 R46.2 R45.2 v1(10.03,3.53)
  Top Layer w0.508: U6.5 19.18,3.51 19.36,3.32 C25.2 20.21,2.78 19.92,2.5 U12.7
  Inner1 w0.254: U12.7 19.92,2.69 19.08,3.53 v1(10.03,3.53)
+5V: length 36.5
  Top Layer w0.254: 10.82,4.46 10.82,5.54 14.6,9.32 v2(15.27,9.32) ; v1(30.5,5.23) 30.53,5.26 C23.2 ; R51.1 v1(30,4.5)
  Top Layer w0.508: 23.5,3.32 24.82,3.32 ; 24.82,3.32 D6.2 ; 24.82,3.32 24.82,4.49 24.65,4.66 Q8.1
  Top Layer w0.762: D6.2 25.65,2.36 25,1.71 U12.9
  Inner2 w0.254: U12.9 27.94,1.27 30,3.33 v1(30,4.5) 30,4.72 v1(30.5,5.23)
  Inner2 w0.762: v2(15.27,9.32) v2(15.27,8.68) 15.27,8.2 18.14,5.33 20.94,5.33 U12.9
GND: length 5.3
  Top Layer w0.254: U9.3 17.33,10.13 U9.9 16.83,11.13 U9.1 ; U13.13 12.19,15.99 U13.3
  vias: v1(1.25,19.53) v1(1.25,18.52) v1(1.25,15.47) v1(1.25,14.45) v1(1.25,13.44) v1(1.25,12.42) v1(1.25,11.41) v1(1.25,10.39) v1(1.25,9.38) v1(1.25,8.36) v1(1.25,7.34) v1(1.25,6.33) v1(1.25,5.31) v1(1.25,2.26) v1(1.25,1.25) v1(2.26,19.53) v1(2.26,18.52) v1(2.26,14.45) v1(2.26,13.44) v1(2.26,12.42) v1(2.26,11.41) v1(2.26,10.39) v1(2.26,9.38) v1(2.26,8.36) v1(2.26,7.34) v1(2.26,6.33) v1(2.26,5.31) v1(2.26,1.25) v1(3.28,19.53) v1(3.28,18.52) v1(3.28,17.5) v1(3.28,15.47) v1(3.28,14.45) v1(3.28,13.44) v1(3.28,6.33) v1(3.28,5.31) v1(3.28,4.3) v1(3.28,2.26) v1(3.28,1.25) v1(4.3,5.31) v1(4.3,4.3) v1(4.3,3.28) v1(4.65,12.09) v1(4.65,11.08) v1(4.65,10.06) v1(5.31,17.5) v1(5.31,14.45) v1(5.31,5.31) v1(5.31,4.3) v1(5.31,3.28) v1(6.33,17.5) v1(6.33,15.47) v1(6.33,14.45) v1(6.33,5.31) v1(6.33,4.3) v1(6.33,3.28) v1(6.33,2.26) v1(7.34,17.5) v1(8.36,18.52) v1(8.36,17.5) v1(8.36,2.26) v1(8.94,7.92) v1(8.94,6.91) v1(8.94,5.89) v1(9.38,17.5) v1(9.38,12.42) v1(10.39,17.5) v1(10.39,12.42) v1(10.39,10.39) v1(10.39,9.38) v1(10.39,8.36) v1(10.39,7.34) v1(10.39,6.33) v1(11.41,12.42) v1(11.41,10.39) v1(11.41,9.38) v1(11.41,8.36) v1(11.41,7.34) v1(11.41,5.31) v1(11.41,2.26) v1(11.88,16.6) v1(11.88,15.59) v1(12.42,17.5) v1(12.42,13.44) v1(12.42,12.42) v1(12.42,10.39) v1(12.42,9.38) v1(12.42,8.36) v1(12.42,6.33) v1(12.42,5.31) v1(12.9,16.6) v1(12.9,15.59) v1(13.44,18.52) v1(13.44,13.44) v1(13.44,12.42) v1(13.44,10.39) v1(13.44,9.38) v1(13.44,7.34) v1(13.44,6.33) v1(13.44,5.31) v1(14.46,17.5) v1(14.46,7.34) v1(15.47,5.31) v1(16.49,17.5) v1(16.49,15.47) v1(16.49,8.36) v1(17.5,17.5) v1(17.5,15.47) v1(17.5,8.36) v1(18.52,18.52) v1(18.52,17.5) v1(18.52,15.47) v1(18.52,14.45) v1(18.52,8.36) v1(18.52,2.26) v1(19.53,7.34) v1(19.53,6.33) v1(19.53,4.3) v1(20.55,7.34) v1(21.21,18.52) v1(21.57,2.26) v1(23.16,7.34) v1(23.75,18.52) v1(24.17,10.39) v1(24.17,9.38) v1(24.17,7.34) v1(25.19,7.34) v1(26.21,19.53) v1(26.21,18.52) v1(26.21,10.39) v1(26.21,4.3) v1(27.22,19.53) v1(27.22,18.52) v1(27.22,7.34) v1(27.22,3.28) v1(28.24,19.53) v1(28.24,18.52) v1(28.24,17.5) v1(28.24,7.34) v1(28.24,3.28) v1(29.25,19.53) v1(29.25,18.52) v1(29.25,17.5) v1(29.25,14.45) v1(29.25,11.41) v1(29.25,10.39) v1(29.25,9.38) v1(29.25,3.28) v1(30.27,19.53) v1(30.27,18.52) v1(30.27,17.5) v1(30.27,2.26) v1(30.27,1.25) v1(31.29,19.53) v1(31.29,18.52) v1(31.29,17.5) v1(31.29,15.47) v1(31.29,3.28) v1(31.29,2.26) v1(31.29,1.25) v1(32.3,19.53) v1(32.3,18.52) v1(32.3,17.5) v1(32.3,15.47) v1(32.31,11.72) v1(32.3,4.3) v1(32.3,3.28) v1(32.3,2.26) v1(32.3,1.25) v1(33.32,16.49) v1(33.32,5.31) v1(33.32,4.3) v1(33.32,3.28) v1(34.33,16.49) v1(34.33,10.39) v1(34.33,8.36) v1(34.33,6.33) v1(34.33,5.31) v1(34.33,4.3) v1(35.35,17.5) v1(35.35,16.49) v1(35.35,7.34) v1(35.35,6.33) v1(35.35,5.31) v1(35.35,4.3) v1(35.35,3.28) v1(35.35,1.25)
VBAT0+: length 32.5
  Top Layer w0.203: 17.34,13.77 15.92,15.19 U13.8
  Top Layer w0.254: v1(10.4,13.28) 10.4,14.68 ; R39.1 25.35,12.75 25.52,12.58 VB+.1
  Top Layer w0.305: U9.8 19.31,11.13 v1(19.61,11.43)
  Top Layer w0.508: 17.34,13.77 v2(18.18,13.77) 18.69,13.77 19.12,13.33 21.59,13.33 22.66,12.26 22.66,11.36 ; VB+.1 22.66,11.36 ; 22.66,11.36 20.65,9.35 ; C24.2 20.57,9.28
  Inner2 w0.254: v2(18.18,13.77) 17.01,14.94 11.81,14.94 10.4,13.53 v1(10.4,13.28)
  Inner2 w0.381: v2(20.62,9.33) 19.61,10.35 v1(19.61,11.43)
VBAT+: length 27.4
  Top Layer w0.254: R57.1 14.64,13.77 14.37,14.04 14.37,14.68 ; v1(28.85,15.27) R61.1
  Top Layer w0.508: v2(22.94,10.31) 22.94,9.25 21.66,7.97 Q8.3 ; R57.1 15.81,12.96 v2(15.81,12.95)
  Inner2 w0.254: v1(28.85,15.27) 22.81,15.27 20.24,12.7
  Inner2 w0.508: v2(22.94,10.31) 21.33,10.31 20.7,10.95 20.7,12.24 20.24,12.7 16.06,12.7 v2(15.81,12.95)
VBAT-: length 20.1
  Top Layer w0.508: 25.79,17.53 25.81,17.52 U7.6 ; 25.79,17.53 26.95,17.53 27.15,17.32 C17.1 27.7,16.73 28.09,16.33 28.09,13.33 27,12.24 27,9.22 26.5,8.72 VB-.1 ; 25.79,17.53 20.07,17.53 19.89,17.35 Q7.1
VIN: length 16.3
  Top Layer w0.254: 18.24,7.57 18.57,7.57 18.76,7.38 U6.1
  Top Layer w0.381: 26.56,5.67 26.56,5.67 D1.1
  Top Layer w0.508: U6.1 18.76,5.17 18.92,5 C18.2 20.84,5 21.25,4.6 22.43,4.6 22.73,4.9 22.73,6.25 23.05,6.56 Q8.2 25.52,6.56 25.65,6.43 D6.1
  Top Layer w0.762: C22.1 27.75,5.67 D6.1
GPOUT: length 20
  Top Layer w0.203: U13.12 v1(15.02,16.79)
  Inner2 w0.254: v1(15.02,16.79) 31.77,16.79 v1(33.1,15.47)
  Bottom Layer w0.254: LED9.2 33.12,15.47 v1(33.1,15.47)
I2C_SCL: length 27.4
  Top Layer w0.203: v1(7.26,16.58) 7.26,16.58 U10.B2 ; U13.2 8.75,16.39 v1(8.35,16)
  Top Layer w0.254: U5.8 8.21,9.75 v1(8.97,8.99) ; R45.1 v1(9.55,5.33)
  Inner2 w0.254: U12.6 13.82,4.83 10.06,4.83 v1(9.55,5.33) 9.55,8.41 v1(8.97,8.99) 8.35,9.6 v1(8.35,16) 7.77,16.58 v1(7.26,16.58)
I2C_SDA: length 25.5
  Top Layer w0.203: U10.B1 6.27,16.03 v1(7.31,16.03) 8.08,16.79 U13.1
  Top Layer w0.254: R46.1 v1(8.33,4.95) ; v1(7.31,11.68) 7.31,11 U5.2
  Inner2 w0.254: U12.5 11.89,4.22 9.07,4.22 v1(8.33,4.95) 8.33,7.95 7.31,8.97 v1(7.31,11.68) 7.31,16.03
$1N106648: length 4.4
  Top Layer w0.381: R39.2 26.78,13.35 27.15,13.72 C17.2 U7.5
$1N106789: length 3.5
  Top Layer w0.254: U7.2 24.24,15.64 24.64,15.24 24.64,13.97 24.01,13.35 R40.2
$1N106794: length 1.3
  Top Layer w0.381: U7.3 Q7.4
$1N106798: length 1.3
  Top Layer w0.381: U7.1 Q7.6
$1N107717: length 2.8
  Top Layer w0.254: U5.6 6.41,9.35 5.9,8.85 5.9,8.51 R43.1
$1N107912: length 1.5
  Top Layer w0.254: R48.1 U5.3
$1N107921: length 1.5
  Top Layer w0.254: R47.1 5.38,11.81 5.51,11.69 U5.4
$1N109045: length 16.3
  Top Layer w0.254: U9.6 19.86,10.13 v1(21.49,11.76)
  Inner2 w0.254: v1(33.48,12.63) 26.86,12.63 26.01,11.79 21.51,11.79 v1(21.49,11.76)
  Bottom Layer w0.254: v1(33.48,12.63) 33.48,13.27 LED8.2
$1N109050: length 17.6
  Top Layer w0.254: v1(21.36,12.37) 19.63,10.63 U9.7
  Inner2 w0.254: v1(34.04,12.63) 34.04,12.92 33.73,13.23 26.59,13.23 25.73,12.37 v1(21.36,12.37)
  Bottom Layer w0.254: LED6.2 34.04,12.16 v1(34.04,12.63)
$1N109056: length 12
  Top Layer w0.254: v1(32,4.77) 31.73,4.5 R51.2
  Inner2 w0.254: v1(32,4.77) 35.46,8.23 v1(35.46,11.72) v1(35.46,13.39)
  Bottom Layer w0.254: LED6.1 v1(35.46,11.72) ; LED8.1 v1(35.46,13.39)
$1N109292: length 1.4
  Top Layer w0.254: U9.2 R50.1
$1N117711: length 4.4
  Top Layer w0.254: R59.2 17.05,7.57 16.85,7.38 U6.3 Q9.3
$1N117737: length 2.6
  Top Layer w0.254: 10.82,3.59 Q9.2
$1N124047: length 25.3
  Top Layer w0.254: v1(29.29,7.7) 29.97,7.01 31.85,7.01 ; U5.1 C20.1 v1(10.11,10.99)
  Inner2 w0.254: v1(29.29,7.7) 28.8,8.18 19.69,8.18 16.88,10.99 v1(10.11,10.99)
$1N125737: length 5.6
  Top Layer w0.254: v1(30.91,14.96) 30.61,15.27 R61.2
  Inner2 w0.254: v1(30.91,14.96) 31.6,14.27 34.65,14.27 v1(34.85,14.48)
  Bottom Layer w0.254: LED9.1 v1(34.85,14.48)
$1N125738: length 1.4
  Top Layer w0.203: U13.10 R62.1
$1N125753: length 1.4
  Top Layer w0.254: U13.5 9.07,15.19

## Copper pours and planes (outline as drawn; the poured copper is in the pictures)
+5V on Top Layer: 15.01,9.75 14.76,9.5 14.76,8.46 14.96,8.25 15.65,8.25 15.85,8.46 15.85,9.31 16.17,9.63 16.05,9.75
GND on Top Layer: -3.12,23.65 38.68,23.65 38.68,-3.51 -3.12,-3.51
GND on Bottom Layer: -3.13,22.91 38.1,22.91 38.1,-1.75 -3.13,-1.75
GND on Inner1: -3.43,22.91 37.29,22.91 37.29,-1.35 -3.43,-1.35
GND on Inner2: -2.34,22.73 38.51,22.73 38.51,-0.91 -2.34,-0.91
VBAT0+ on Top Layer: 19.3,9.75 20.5,9.75 20.68,9.58 20.68,9.09 20.47,8.89 19.71,8.89 19.08,9.51 19.08,9.53

Small or netless copper shapes (teardrops, artwork), in the pictures only: 1 on Top Layer

## Text on the board
Top Silkscreen Layer: T | sens | RTC | Battery / Gauge | CHARGER | Riset | RoboHiKi | dev0.1 | AG0
